# Altium project HUB_USB_3.0.PrjPcb (part 3 of 3)

## Sheet USB_HUB1 DN PORT 6.SchDoc: USB_HUB 3.0
size A2; DrawnBy: Luca Schenetti; Revision: A; SheetNumber: 11; SheetTotal: 10
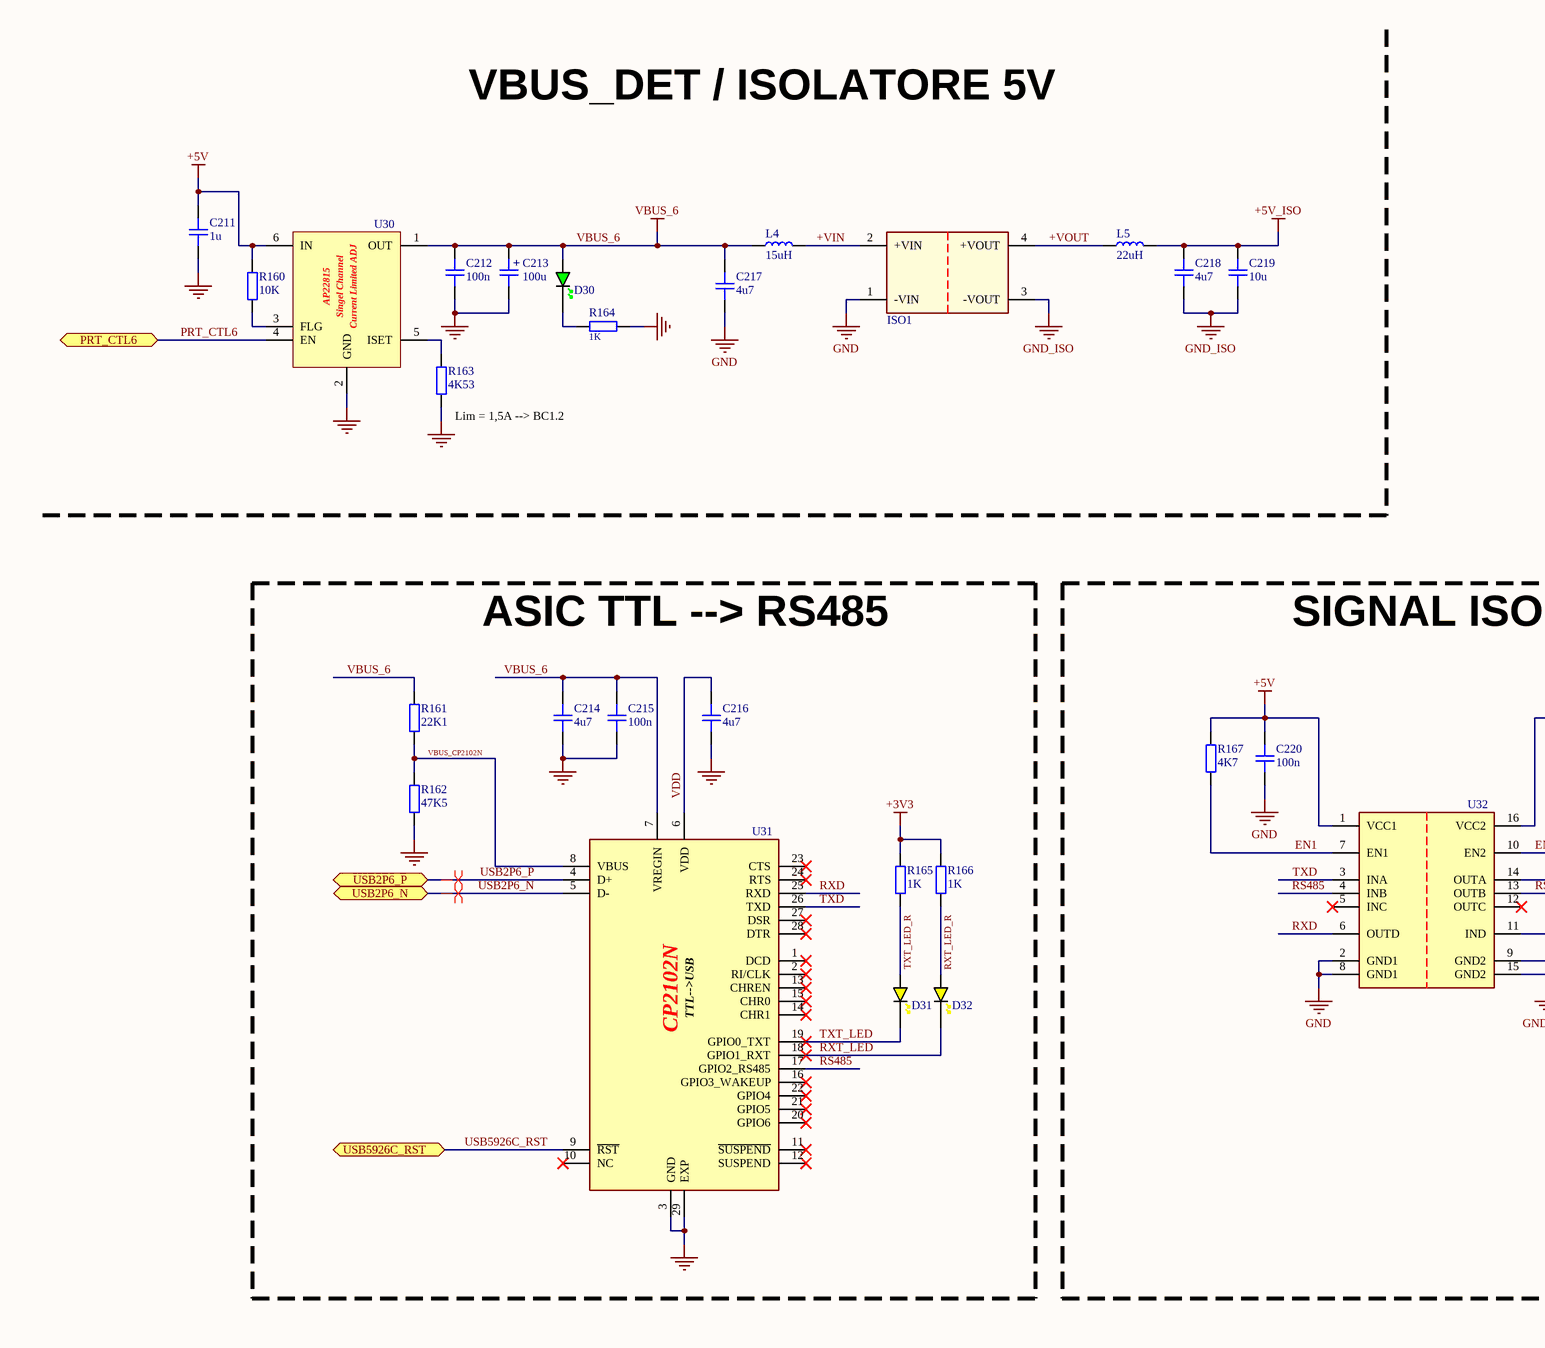
[diagram p17: USB_HUB1 DN PORT 6.SchDoc, left]
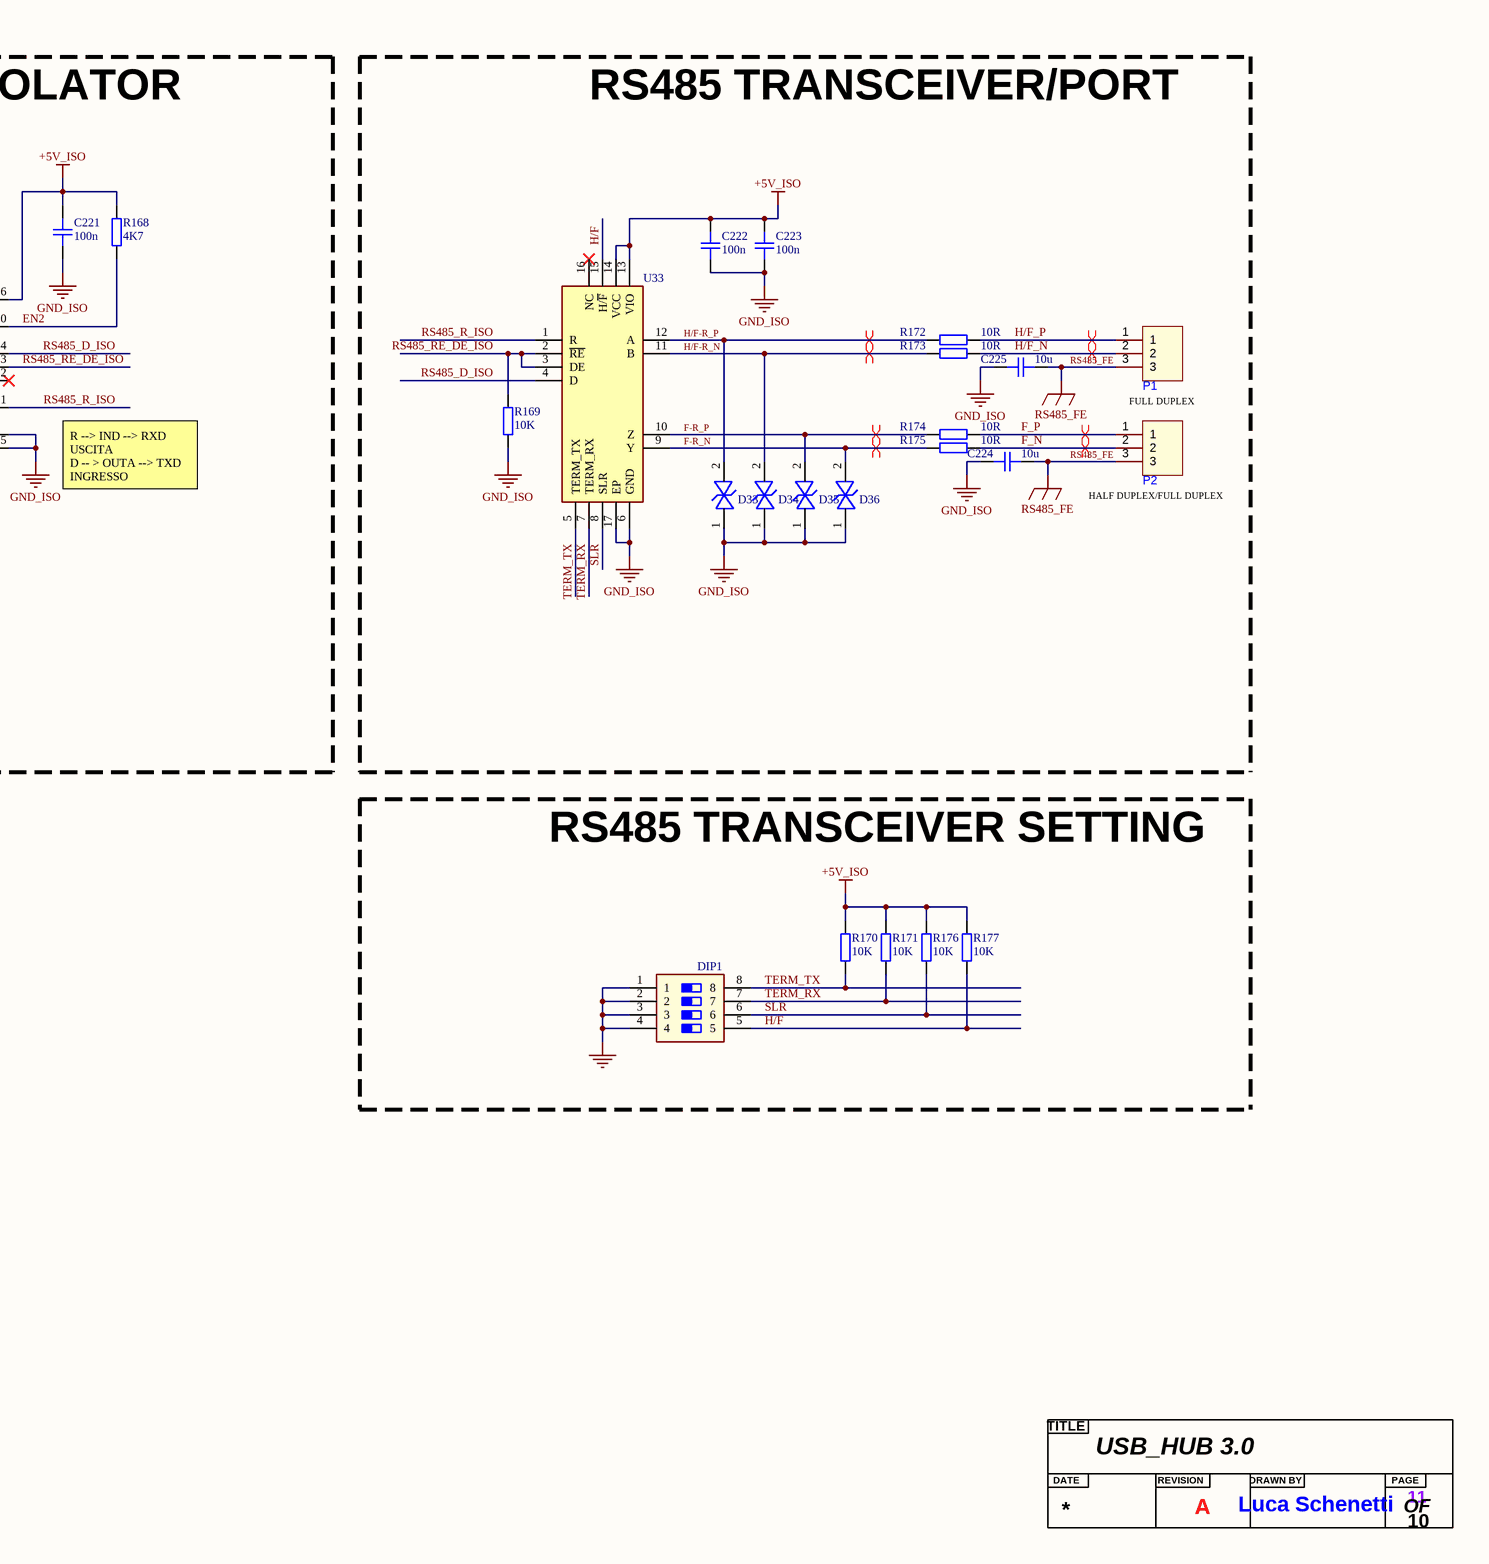
[diagram p18: USB_HUB1 DN PORT 6.SchDoc, right]

### Parts
(Parts that share a designator on the sheet are numbered #1, #2 ... from top to bottom, then left to right.)
?#11  Title  (value not drawn)  (graphical)
C211  1u  [CAP_0603]
C212  100n  [CAP_0603]
C213  100u  [CAP_AE_SMD_D6MM3_H5M55]
C214  4u7  [CAP_0603]
C215  100n  [CAP_0603]
C216  4u7  [CAP_0603]
C217  4u7  [CAP_0603]
C218  4u7  [CAP_0603]
C219  10u  [CAP_0603]
C220  100n  [CAP_0603]
C221  100n  [CAP_0603]
C222  100n  [CAP_0603]
C223  100n  [CAP_0603]
C224  10u  [CAP_1206]
C225  10u  [CAP_1206]
D30  GREEN  [LED_0603_GREEN]  (value not drawn)
D31  YELLOW  [LED_0603_YELLOW]  (value not drawn)
D32  YELLOW  [LED_0603_YELLOW]  (value not drawn)
D33  TVS BID 6.8A 29.2V  [SMF18CA]  (value not drawn)
D34  TVS BID 6.8A 29.2V  [SMF18CA]  (value not drawn)
D35  TVS BID 6.8A 29.2V  [SMF18CA]  (value not drawn)
D36  TVS BID 6.8A 29.2V  [SMF18CA]  (value not drawn)
DIP1  DIP SPST 4P  [1825360-3]  (value not drawn)
ISO1  DC-DC Converter  [RFM-0505S]  (value not drawn)
L4  15uH  [IND_0603]
L5  22uH  [IND_1008]
P1  WJ500V-5.08-3P  [CONN-TH_3P-P5.00_WJ500V-5.08-3P]  (value not drawn)
P2  WJ500V-5.08-3P  [CONN-TH_3P-P5.00_WJ500V-5.08-3P]  (value not drawn)
R160  10K  [RES_0603]
R161  22K1  [RES_0603]
R162  47K5  [RES_0603]
R163  4K53  [RES_0603]
R164  1K  [RES_0603]
R165  1K  [RES_0402]
R166  1K  [RES_0402]
R167  4K7  [RES_0603]
R168  4K7  [RES_0603]
R169  10K  [RES_0603]
R170  10K  [RES_0603]
R171  10K  [RES_0603]
R172  10R  [RES_0603]
R173  10R  [RES_0603]
R174  10R  [RES_0603]
R175  10R  [RES_0603]
R176  10K  [RES_0603]
R177  10K  [RES_0603]
U30  Single-Channel, Current-Limited,ISET  [AP22615AWU-7]  (value not drawn)
U31  USB To UART Bridge USB 2.0  [CP2102N-A02-GQFN28R]  (value not drawn)
U32  Quad-Channel Digital Isolators  [ISO6741DWR]  (value not drawn)
U33  RS-485 / RS-422 --> TTL  [THVD1424RGTR]  (value not drawn)

### Blocks framed on the sheet
ASIC TTL --> RS485: C214-C216 D31 D32 R161 R162 R165 R166 U31
SIGNAL ISOLATOR: C220 C221 R167 R168 U32
RS485 TRANSCEIVER/PORT: C222-C225 D33-D36 P1 P2 R169 R172-R175 U33
RS485 TRANSCEIVER SETTING: DIP1 R170 R171 R176 R177

### Ports
PRT_CTL6 (bidir, see USB_HUB1[6D]), USB2P6_N (bidir, see USB_HUB1[6D]), USB2P6_P (bidir, see USB_HUB1[6D]), USB5926C_RST (bidir, see MCU[8C], USB_HUB1 DN PORT 1_2[5B], USB_HUB1 DN PORT 1_2[5D], USB_HUB1 DN PORT 5[3D], USB_HUB1 UP PORT0[5C], USB_HUB1[3C])

### Nets
+3V3: R165.2 R166.2
+5V: C211.2 C220.2 R160.2 R167.2 U30.6(IN) U32.1(VCC1)
+5V_ISO: C218.2 C219.2 C221.2 C222.2 C223.2 L5.2 R168.2 R170.2 R171.2 R176.2 R177.2 U32.16(VCC2) U33.13(VIO) U33.14(VCC)
GND: C211.1 C212.1 C213.2 C214.1 C215.1 C216.1 C217.1 C220.1 DIP1.1 DIP1.2 DIP1.3 DIP1.4 ISO1.1(-VIN) R162.1 R163.1 R164.2 U30.2(GND) U31.3(GND) U31.29(EXP) U32.2(GND1) U32.8(GND1)
GND_ISO: C218.1 C219.1 C221.1 C222.1 C223.1 C224.1 C225.1 D33.1(C) D34.1(C) D35.1(C) D36.1(C) ISO1.3(-VOUT) R169.1 U32.9(GND2) U32.15(GND2) U33.6(GND) U33.17(EP)
RS485_FE: C224.2 C225.2 P1.3 P2.3
VBUS_6: C212.2 C213.1 C214.2 C215.2 C217.2 D30.A L4.1 R161.2 U30.1(OUT) U31.7(VREGIN)
+VIN: ISO1.2(+VIN) L4.2
+VOUT: ISO1.4(+VOUT) L5.1
EN1: R167.1 U32.7(EN1)
EN2: R168.1 U32.10(EN2)
F-R_N: D36.2(A) R175.1 U33.9(Y)
F-R_P: D35.2(A) R174.1 U33.10(Z)
F_N: P2.2 R175.2
F_P: P2.1 R174.2
H/F: DIP1.5 R177.1 U33.15(H/~{F})
H/F-R_N: D34.2(A) R173.1 U33.11(B)
H/F-R_P: D33.2(A) R172.1 U33.12(A)
H/F_N: P1.2 R173.2
H/F_P: P1.1 R172.2
PRT_CTL6: U30.4(EN) ; port PRT_CTL6
RS485: U31.17(GPIO2_RS485) U32.4(INB)
RS485_D_ISO: U32.14(OUTA) U33.4(D)
RS485_R_ISO: U32.11(IND) U33.1(R)
RS485_RE_DE_ISO: R169.2 U32.13(OUTB) U33.2(~{RE}) U33.3(DE)
RXD: U31.25(RXD) U32.6(OUTD)
RXT_LED: D32.K U31.18(GPIO1_RXT)
RXT_LED_R: D32.A R166.1
SLR: DIP1.6 R176.1 U33.8(SLR)
TERM_RX: DIP1.7 R171.1 U33.7(TERM_RX)
TERM_TX: DIP1.8 R170.1 U33.5(TERM_TX)
TXD: U31.26(TXD) U32.3(INA)
TXT_LED: D31.K U31.19(GPIO0_TXT)
TXT_LED_R: D31.A R165.1
USB2P6_N: U31.5(D-) ; port USB2P6_N
USB2P6_P: U31.4(D+) ; port USB2P6_P
USB5926C_RST: U31.9(~{RST}) ; port USB5926C_RST
VBUS_CP2102N: R161.1 R162.2 U31.8(VBUS)
VDD: C216.2 U31.6(VDD)
NetD30_K: D30.K R164.1
NetR160_1: R160.1 U30.3(FLG)
NetR163_2: R163.2 U30.5(ISET)

Not connected (* = marked no-connect by the designer): U31 1(DCD)* 2(RI/CLK)* 10(NC)* 11(~{SUSPEND})* 12(SUSPEND)* 13(CHREN)* 14(CHR1)* 15(CHR0)* 16(GPIO3_WAKEUP)* 20(GPIO6)* 21(GPIO5)* 22(GPIO4)* 23(CTS)* 24(RTS)* 27(DSR)* 28(DTR)*; U32 5(INC)* 12(OUTC)*; U33 16(NC)*

### Layout directives
differential pair; differential pair class DIFF_RS485_120Ω: F-R_N, F-R_P, F_N, F_P, H/F-R_N, H/F-R_P, H/F_N, H/F_P
differential pair; differential pair class DIFF_USB_90Ω: USB2P6_N, USB2P6_P

### Notes on the sheet
- VBUS_DET / ISOLATORE 5V
- (near R163) Lim = 1,5A --> BC1.2
- FULL DUPLEX
- R --> IND --> RXD USCITA
  D -- > OUTA --> TXD INGRESSO
- (near P2) HALF DUPLEX/FULL DUPLEX
- (in symbol AP22615AWU-7) AP22815; Singel Channel; Current Limited ADJ
- (in symbol CAP_ALEL_6.3x5.5) +
- (in symbol CP2102N-A02-GQFN28R) CP2102N; TTL-->USB
- (in symbol Title) TITLE; DATE; REVISION; DRAWN BY; PAGE; OF

### Library data of the parts
C211 = CAP_0603: Capacitor SMD 0603 [C15849]; Manufacturer: *; Manufacturer Part Number: *; Distributor Link: *; LCSC: *; Rating: *; Dielectric: *
C212 C215 C220-C223 = CAP_0603: Capacitor SMD 0603 [C14663]; Manufacturer: *; Manufacturer Part Number: *; Distributor Link: *; LCSC: *; Rating: *; Dielectric: *
C213 = CAP_ALEL_6.3x5.5: [C59936]; Manufacturer: *; Manufacturer Part Number: *; Distributor Link: *; LCSC: *
C214 C216-C218 = CAP_0603: [C19666]; Manufacturer: *; Manufacturer Part Number: *; Distributor Link: *; LCSC: *; Rating: *; Dielectric: *
C219 = CAP_0603: [C96446]; Manufacturer: *; Manufacturer Part Number: *; Distributor Link: *; LCSC: *; Rating: *; Dielectric: *
C224 C225 = CAP_1206: Capacitor SMD 1206 [C13585]; Manufacturer: *; Manufacturer Part Number: *; Distributor Link: *; LCSC: *; Rating: *; Dielectric: *
D30 = LED_0603_GREEN: [C2986059]
D31 D32 = LED_0603_YELLOW: LED 0603 YELLOW SMD[C72038]
D33-D36 = SMF18CA: [C19077513]
DIP1 = 1825360-3: [C574798]
ISO1 = RFM-0505S: [C22371855]
L4 = IND_0603: [C18221256]
L5 = IND_1008: [C65856]
P1 P2 = WJ500V-5.08-3P: [C72334]; Manufacturer: KANGNEX(康奈克斯电气); Symbol: WJ500V-5.08-3P-14-00A; Add into BOM: yes; Structure: 1x3P; Pitch: 5.08mm; Current Rating (Max): 18A; Voltage Rating (Max): 250V; Wire Gauge - AWG: 14~30; Wire Gauge - mm2: 2.5; Number of PINs Per Row: 3; Device: WJ500V-5.08-3P; LCSC Part Name: 5.08mm 1x3P 排数:1 每排P数:3 直插; Supplier Part: C72334; Manufacturer Part: WJ500V-5.08-3P; Supplier Footprint: 插件,P=5.08mm; JLCPCB Part Class: Extended Part; Datasheet: https://atta.szlcsc.com/upload/public/pdf/source/20191225/C72334_8A5EF831D67650233B6B1E3F2BC06274.pdf; Supplier: LCSC; Convert to PCB: yes; Color: Green; Mounting Style: Straight; Number of Pins: 3P; Number of Rows: 1; Operating Temperature Range: -40℃~+105℃
R160 R169-R171 R176 R177 = RES_0603: [C25804]; Manufacturer: *; Manufacturer Part Number: *; Distributor Link: *; LCSC: *
R161 = RES_0603: [C2960862]; Manufacturer: *; Manufacturer Part Number: *; Distributor Link: *; LCSC: *
R162 = RES_0603: [C2933225]; Manufacturer: *; Manufacturer Part Number: *; Distributor Link: *; LCSC: *
R163 = RES_0603: [C25971]; Manufacturer: *; Manufacturer Part Number: *; Distributor Link: *; LCSC: *
R164 = RES_0603: [C21190]; Manufacturer: *; Manufacturer Part Number: *; Distributor Link: *; LCSC: *
R165 R166 = RES_0402: Resistor SMD 0402 [C11702]; Manufacturer: *; Manufacturer Part Number: *; Distributor Link: *; LCSC: *
R167 R168 = RES_0603: [C23162]; Manufacturer: *; Manufacturer Part Number: *; Distributor Link: *; LCSC: *
R172-R175 = RES_0603: [C22859]; Manufacturer: *; Manufacturer Part Number: *; Distributor Link: *; LCSC: *
U30 = AP22615AWU-7: [C2680357]
U31 = CP2102N-A02-GQFN28R: [C964632]
U32 = ISO6741DWR: [C5216432]
U33 = THVD1424RGTR: [C5359161]

## Nets that join several sheets
+1V2: PWR (C22.2 R18.2 TP4.1 U3.1), USB_HUB1 (FB1.1), USB_HUB1 DN PORT 3 (FB3.1)
+3V3: PWR (9 pins), MCU (D25.A1 D25.B1 SW1.1 U23.30), USB_HUB1 (9 pins), USB_HUB1 UP PORT0 (C68.2 C74.2 U9.8 U9.10), USB_HUB1 DN PORT 1_2 (17 pins), USB_HUB1 DN PORT 3 (12 pins), USB_HUB1 DN PORT 5 (13 pins), USB_HUB1 DN PORT 6 (R165.2 R166.2)
+3V3_IN_PWR: PWR (11 pins), MCU (D23.A1 D23.B1)
+3V3_MCU: MCU (23 pins), USB_HUB1 UP PORT0 (R50.2 R51.2 R52.2), USB_HUB1 DN PORT 1_2 (R77.2)
+5V: PWR (8 pins), MCU (R144.2), USB_HUB1 UP PORT0 (5 pins), USB_HUB1 DN PORT 1_2 (14 pins), USB_HUB2 DN PORT (12 pins), USB_HUB1 DN PORT 4 (C206.2 R156.2 U29.6), USB_HUB1 DN PORT 6 (6 pins)
GND: PWR (56 pins), MCU (36 pins), USB_HUB1 (33 pins), USB_HUB1 UP PORT0 (36 pins), USB_HUB1 DN PORT 1_2 (78 pins), USB_HUB1 DN PORT 3 (30 pins), USB_HUB2 DN PORT (48 pins), USB_HUB1 DN PORT 4 (34 pins), USB_HUB1 DN PORT 5 (33 pins), USB_HUB1 DN PORT 6 (21 pins)
C_AB0: USB_HUB1 (U8.60), USB_HUB1 UP PORT0 (R55.2 U9.18)
C_AB1: USB_HUB1 (U8.50), USB_HUB1 DN PORT 1_2 (R80.2 U11.18)
C_AB2: USB_HUB1 (U8.71), USB_HUB1 DN PORT 1_2 (R81.2 U10.18)
C_ATTACH0: USB_HUB1 (U8.76), USB_HUB1 UP PORT0 (R59.2 U9.19)
C_ATTACH1: USB_HUB1 (U8.73), USB_HUB1 DN PORT 1_2 (R88.2 U11.19)
C_ATTACH2: USB_HUB1 (U8.56), USB_HUB1 DN PORT 1_2 (R89.2 U10.19)
FAULT_PWR: PWR (U1.9), MCU (U23.3)
HPI_INT: PWR (U1.7), MCU (U23.13)
I2C3_SCL: PWR (U1.13 U7.5), MCU (U23.29), USB_HUB1 UP PORT0 (R50.1 U9.15), USB_HUB1 DN PORT 1_2 (U10.15 U11.15)
I2C3_SDA: PWR (U1.12 U7.6), MCU (U23.45), USB_HUB1 UP PORT0 (R51.1 U9.13), USB_HUB1 DN PORT 1_2 (U10.13 U11.13)
IRQ_N_1_UP: MCU (U23.16), USB_HUB1 UP PORT0 (R52.1 U9.21)
IRQ_N_DN_1: MCU (U23.17), USB_HUB1 DN PORT 1_2 (R76.1 U11.21)
IRQ_N_DN_2: MCU (U23.14), USB_HUB1 DN PORT 1_2 (R77.1 U10.21)
LED_RD_FAULT_PWR: PWR (D1.A), MCU (U23.4)
MCU_MDC: MCU (U23.19), USB_HUB1 DN PORT 5 (U17.22)
MCU_MDIO: MCU (U23.18), USB_HUB1 DN PORT 5 (R116.1 U17.23)
PRT_CTL1: USB_HUB1 (U8.70), USB_HUB1 DN PORT 1_2 (U11.17)
PRT_CTL1_HUB2: USB_HUB1 DN PORT 3 (U14.38), USB_HUB2 DN PORT (U18.4)
PRT_CTL2: USB_HUB1 (U8.58), USB_HUB1 DN PORT 1_2 (U10.17)
PRT_CTL2_HUB2: USB_HUB1 DN PORT 3 (U14.37), USB_HUB2 DN PORT (U19.4)
PRT_CTL3: USB_HUB1 (U8.52), USB_HUB1 DN PORT 3 (U15.4)
PRT_CTL3_HUB2: USB_HUB1 DN PORT 3 (U14.36), USB_HUB2 DN PORT (U20.4)
PRT_CTL4: USB_HUB1 (U8.51), USB_HUB1 DN PORT 4 (U29.4)
PRT_CTL4_HUB2: USB_HUB1 DN PORT 3 (U14.34), USB_HUB2 DN PORT (U21.4)
PRT_CTL5: USB_HUB1 (U8.62), USB_HUB1 DN PORT 5 (U16.4)
PRT_CTL6: USB_HUB1 (U8.57), USB_HUB1 DN PORT 6 (U30.4)
SMBus1_SCL: MCU (U23.42), USB_HUB1 (R34.1 U8.75)
SMBus1_SDA: MCU (U23.43), USB_HUB1 (R35.1 U8.74)
SMBus2_SCL: MCU (U23.21), USB_HUB1 DN PORT 3 (R99.1 U14.47)
SMBus2_SDA: MCU (U23.46), USB_HUB1 DN PORT 3 (R98.1 U14.46)
USB2P0_N: USB_HUB1 (U8.95), USB_HUB1 UP PORT0 (TVS2.2 TVS2.9 USB1.A7 USB1.B7)
USB2P0_P: USB_HUB1 (U8.94), USB_HUB1 UP PORT0 (TVS2.1 TVS2.10 USB1.A6 USB1.B6)
USB2P1_H2_N: USB_HUB1 DN PORT 3 (U14.3), USB_HUB2 DN PORT (TVS13.2 TVS13.5 USB4.2)
USB2P1_H2_P: USB_HUB1 DN PORT 3 (U14.2), USB_HUB2 DN PORT (TVS13.3 USB4.3)
USB2P1_N: USB_HUB1 (U8.7), USB_HUB1 DN PORT 1_2 (TVS5.2 TVS5.9 USB2.A7 USB2.B7)
USB2P1_P: USB_HUB1 (U8.6), USB_HUB1 DN PORT 1_2 (TVS5.1 TVS5.10 USB2.A6 USB2.B6)
USB2P2_H2_N: USB_HUB1 DN PORT 3 (U14.10), USB_HUB2 DN PORT (TVS14.2 TVS14.5 USB4.12)
USB2P2_H2_P: USB_HUB1 DN PORT 3 (U14.9), USB_HUB2 DN PORT (TVS14.3 USB4.11)
USB2P2_N: USB_HUB1 (U8.29), USB_HUB1 DN PORT 1_2 (TVS7.2 TVS7.9 USB3.A7 USB3.B7)
USB2P2_P: USB_HUB1 (U8.28), USB_HUB1 DN PORT 1_2 (TVS7.1 TVS7.10 USB3.A6 USB3.B6)
USB2P3_H2_N: USB_HUB1 DN PORT 3 (U14.20), USB_HUB2 DN PORT (TVS17.2 TVS17.5 USB5.2)
USB2P3_H2_P: USB_HUB1 DN PORT 3 (U14.19), USB_HUB2 DN PORT (TVS17.3 USB5.3)
USB2P3_N: USB_HUB1 (U8.44), USB_HUB1 DN PORT 3 (U14.54)
USB2P3_P: USB_HUB1 (U8.43), USB_HUB1 DN PORT 3 (U14.53)
USB2P4_H2_N: USB_HUB1 DN PORT 3 (U14.27), USB_HUB2 DN PORT (TVS18.2 TVS18.5 USB5.12)
USB2P4_H2_P: USB_HUB1 DN PORT 3 (U14.26), USB_HUB2 DN PORT (TVS18.3 USB5.11)
USB2P4_N: USB_HUB1 (U8.87), USB_HUB1 DN PORT 4 (U27.31)
USB2P4_P: USB_HUB1 (U8.86), USB_HUB1 DN PORT 4 (U27.32)
USB2P5_N: USB_HUB1 (U8.14), USB_HUB1 DN PORT 5 (U17.11)
USB2P5_P: USB_HUB1 (U8.13), USB_HUB1 DN PORT 5 (U17.12)
USB2P6_N: USB_HUB1 (U8.36), USB_HUB1 DN PORT 6 (U31.5)
USB2P6_P: USB_HUB1 (U8.35), USB_HUB1 DN PORT 6 (U31.4)
USB3RX1_H2_N: USB_HUB1 DN PORT 3 (U14.8), USB_HUB2 DN PORT (TVS11.5 TVS11.6 USB4.5)
USB3RX1_H2_P: USB_HUB1 DN PORT 3 (U14.7), USB_HUB2 DN PORT (TVS11.4 TVS11.7 USB4.6)
USB3RX2_H2_N: USB_HUB1 DN PORT 3 (U14.15), USB_HUB2 DN PORT (TVS12.5 TVS12.6 USB4.14)
USB3RX2_H2_P: USB_HUB1 DN PORT 3 (U14.14), USB_HUB2 DN PORT (TVS12.4 TVS12.7 USB4.15)
USB3RX3_H2_N: USB_HUB1 DN PORT 3 (U14.25), USB_HUB2 DN PORT (TVS15.5 TVS15.6 USB5.5)
USB3RX3_H2_P: USB_HUB1 DN PORT 3 (U14.24), USB_HUB2 DN PORT (TVS15.4 TVS15.7 USB5.6)
USB3RX3_N: USB_HUB1 (U8.49), USB_HUB1 DN PORT 3 (C124.2)
USB3RX3_P: USB_HUB1 (U8.48), USB_HUB1 DN PORT 3 (C123.2)
USB3RX4_H2_N: USB_HUB1 DN PORT 3 (U14.32), USB_HUB2 DN PORT (TVS16.5 TVS16.6 USB5.14)
USB3RX4_H2_P: USB_HUB1 DN PORT 3 (U14.31), USB_HUB2 DN PORT (TVS16.4 TVS16.7 USB5.15)
USB3RX4_N: USB_HUB1 (U8.92), USB_HUB1 DN PORT 4 (C194.2)
USB3RX4_P: USB_HUB1 (U8.91), USB_HUB1 DN PORT 4 (C193.2)
USB3RX_A0_N: USB_HUB1 (U8.100), USB_HUB1 UP PORT0 (TVS1.5 TVS1.6 USB1.B10)
USB3RX_A0_P: USB_HUB1 (U8.99), USB_HUB1 UP PORT0 (TVS1.4 TVS1.7 USB1.B11)
USB3RX_A1_N: USB_HUB1 (U8.12), USB_HUB1 DN PORT 1_2 (TVS4.5 TVS4.6 USB2.B10)
USB3RX_A1_P: USB_HUB1 (U8.11), USB_HUB1 DN PORT 1_2 (TVS4.4 TVS4.7 USB2.B11)
USB3RX_A2_N: USB_HUB1 (U8.34), USB_HUB1 DN PORT 1_2 (TVS6.5 TVS6.6 USB3.B10)
USB3RX_A2_P: USB_HUB1 (U8.33), USB_HUB1 DN PORT 1_2 (TVS6.4 TVS6.7 USB3.B11)
USB3RX_B0_N: USB_HUB1 (U8.85), USB_HUB1 UP PORT0 (TVS3.5 TVS3.6 USB1.A10)
USB3RX_B0_P: USB_HUB1 (U8.84), USB_HUB1 UP PORT0 (TVS3.4 TVS3.7 USB1.A11)
USB3RX_B1_N: USB_HUB1 (U8.19), USB_HUB1 DN PORT 1_2 (TVS8.5 TVS8.6 USB2.A10)
USB3RX_B1_P: USB_HUB1 (U8.18), USB_HUB1 DN PORT 1_2 (TVS8.4 TVS8.7 USB2.A11)
USB3RX_B2_N: USB_HUB1 (U8.41), USB_HUB1 DN PORT 1_2 (TVS9.5 TVS9.6 USB3.A10)
USB3RX_B2_P: USB_HUB1 (U8.40), USB_HUB1 DN PORT 1_2 (TVS9.4 TVS9.7 USB3.A11)
USB3TX1_H2_N: USB_HUB1 DN PORT 3 (U14.5), USB_HUB2 DN PORT (C157.1)
USB3TX1_H2_P: USB_HUB1 DN PORT 3 (U14.4), USB_HUB2 DN PORT (C156.1)
USB3TX2_H2_N: USB_HUB1 DN PORT 3 (U14.12), USB_HUB2 DN PORT (C159.1)
USB3TX2_H2_P: USB_HUB1 DN PORT 3 (U14.11), USB_HUB2 DN PORT (C158.1)
USB3TX3_H2_N: USB_HUB1 DN PORT 3 (U14.22), USB_HUB2 DN PORT (C168.1)
USB3TX3_H2_P: USB_HUB1 DN PORT 3 (U14.21), USB_HUB2 DN PORT (C167.1)
USB3TX3_N: USB_HUB1 (U8.46), USB_HUB1 DN PORT 3 (C122.2)
USB3TX3_P: USB_HUB1 (U8.45), USB_HUB1 DN PORT 3 (C121.2)
USB3TX4_H2_N: USB_HUB1 DN PORT 3 (U14.29), USB_HUB2 DN PORT (C170.1)
USB3TX4_H2_P: USB_HUB1 DN PORT 3 (U14.28), USB_HUB2 DN PORT (C169.1)
USB3TX4_N: USB_HUB1 (U8.89), USB_HUB1 DN PORT 4 (C196.2)
USB3TX4_P: USB_HUB1 (U8.88), USB_HUB1 DN PORT 4 (C195.2)
USB3TX_A0_N: USB_HUB1 (U8.97), USB_HUB1 UP PORT0 (C63.2)
USB3TX_A0_P: USB_HUB1 (U8.96), USB_HUB1 UP PORT0 (C62.2)
USB3TX_A1_N: USB_HUB1 (U8.9), USB_HUB1 DN PORT 1_2 (C82.2)
USB3TX_A1_P: USB_HUB1 (U8.8), USB_HUB1 DN PORT 1_2 (C81.2)
USB3TX_A2_N: USB_HUB1 (U8.31), USB_HUB1 DN PORT 1_2 (C87.2)
USB3TX_A2_P: USB_HUB1 (U8.30), USB_HUB1 DN PORT 1_2 (C86.2)
USB3TX_B0_N: USB_HUB1 (U8.82), USB_HUB1 UP PORT0 (C65.2)
USB3TX_B0_P: USB_HUB1 (U8.81), USB_HUB1 UP PORT0 (C64.2)
USB3TX_B1_N: USB_HUB1 (U8.16), USB_HUB1 DN PORT 1_2 (C84.2)
USB3TX_B1_P: USB_HUB1 (U8.15), USB_HUB1 DN PORT 1_2 (C83.2)
USB3TX_B2_N: USB_HUB1 (U8.38), USB_HUB1 DN PORT 1_2 (C89.2)
USB3TX_B2_P: USB_HUB1 (U8.37), USB_HUB1 DN PORT 1_2 (C88.2)
USB5734T_RST: MCU (U26.4), USB_HUB1 DN PORT 3 (U14.48)
USB5926_VBUS_DET: USB_HUB1 (U8.24), USB_HUB1 UP PORT0 (R45.2 R46.2)
USB5926C_RST: MCU (U25.4), USB_HUB1 (U8.25), USB_HUB1 UP PORT0 (U9.22), USB_HUB1 DN PORT 1_2 (U10.22 U11.22), USB_HUB1 DN PORT 5 (U17.24), USB_HUB1 DN PORT 6 (U31.9)
USB-C_PORT_1_VEL1: MCU (U23.11), USB_HUB1 DN PORT 1_2 (D10.3)
USB-C_PORT_1_VEL2: MCU (U23.12), USB_HUB1 DN PORT 1_2 (D10.4)
USB-C_PORT_2_VEL1: MCU (U23.25), USB_HUB1 DN PORT 1_2 (D11.3)
USB-C_PORT_2_VEL2: MCU (U23.26), USB_HUB1 DN PORT 1_2 (D11.4)